# Altium schematic sheet SPK_P.SchDoc
size A; SheetNumber: 4; SheetTotal: 6; SPICEModelCacheEZHXWKXH: <root> / <DocumentId>EZHXWKXH</DocumentId> / <CacheFrame Number="0"> / <Model Name="2n3904" Kind="MDL"> / <Text>*2N3904 / *Si 310mW  40V 200mA 300MHz pkg:TO-92B 1,2,3 / .MODEL 2N3904 NPN(IS=1.4E-14 BF=300 VAF=100 IKF=0.025 ISE=3E-13 / + BR=7.5 RC=2.4 CJE=4.5E-12 TF=4E-10 CJC=3.5E-12 TR=2.1E-8 XTB=1.5 KF=9E-16 )</Text> / </Model> / <Model Name="2n3906" Kind="MDL"> / <Text>*2N3906 / *Si 310mW  40V 200mA 250MHz pkg:TO-92B 1,2,3 / .MODEL 2N3906 PNP(IS=4E-14 BF=400 VAF=50 IKF=0.02 ISE=7E-15 NE=1.16 / + BR=7.5 RC=2.4 CJE=6.3E-12 VJE=0.75 TF=5E-10 CJC=5.8E-12 VJC=0.75 TR=2.3E-8 / + VJS=0.75 XTB=1.5 KF=6E-16 )</Text> / </Model> / </CacheFrame> / </root>
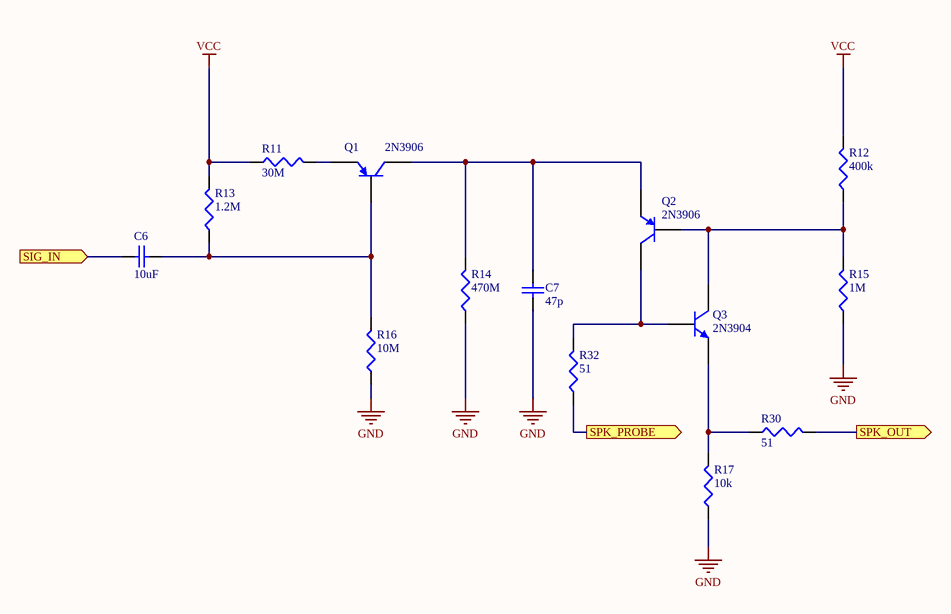
[diagram p0: SPK_P.SchDoc]

## Parts
C6  10uF  [SMD-0603]
C7  47p  [SMD-0603]
Q1  2N3906  [TO-92A]
Q2  2N3906  [TO-92A]
Q3  2N3904  [TO-92A]
R11  30M  [SMD-0603]
R12  400k  [SMD-0603]
R13  1.2M  [SMD-0603]
R14  470M  [SMD-0603]
R15  1M  [SMD-0603]
R16  10M  [SMD-0603]
R17  10k  [SMD-0603]
R30  51  [SMD-0603]
R32  51  [SMD-0603]

## Ports
SIG_IN (in), SPK_OUT (out), SPK_PROBE (out)

## Nets
GND: C7.1 R14.1 R15.1 R16.1 R17.1
VCC: R11.1 R12.2 R13.2
SIG_IN: C6.1 ; port SIG_IN
SPK_OUT: R30.2 ; port SPK_OUT
SPK_PROBE: R32.1 ; port SPK_PROBE
NetC6_2: C6.2 Q1.2(B) R13.1 R16.2
NetC7_2: C7.2 Q1.3(C) Q2.1(E) R14.2
NetQ1_1: Q1.1(E) R11.2
NetQ2_2: Q2.2(B) Q3.3(C) R12.1 R15.2
NetQ2_3: Q2.3(C) Q3.2(B) R32.2
NetQ3_1: Q3.1(E) R17.2 R30.1

## Library data of the parts
C6 C7 = CAP0603: Ceramic Capacitor 0603
Q1 Q2 = 2N3906: PNP General Purpose Amplifier; Published: 8-Jun-2000; LatestRevisionDate: 15-Jan-2003; LatestRevisionNote: PCB Footprint 'BCY-W3/D4.7' replaced; DatasheetVersion: 1997; PackageVersion: Sep-1998; PackageReference: TO-92A; Publisher: Altium Limited; PackageDescription: TO, Flat Index; 3 In-Line, Axial Leads; Body Dia. 4.5mm; Leads 0.51 x 0.48 mm (max); ComponentLink1Description: Manufacturer Link; ComponentLink1URL: http://www.fairchildsemi.com/; ComponentLink2Description: Datasheet; ComponentLink2URL: http://www.fairchildsemi.com/ds/2N%2F2N3906.pdf
Q3 = 2N3904: NPN General Purpose Amplifier; Published: 8-Jun-2000; LatestRevisionDate: 15-Jan-2003; LatestRevisionNote: PCB Footprint 'BCY-W3/D4.7' replaced; DatasheetVersion: 1997; PackageVersion: Sep-1998; PackageReference: TO-92A; Publisher: Altium Limited; PackageDescription: TO, Flat Index; 3 In-Line, Axial Leads; Body Dia. 4.5mm; Leads 0.51 x 0.48 mm (max); ComponentLink1Description: Manufacturer Link; ComponentLink1URL: http://www.fairchildsemi.com/; ComponentLink2Description: Datasheet; ComponentLink2URL: http://www.fairchildsemi.com/ds/2N%2F2N3904.pdf
R11-R17 R30 R32 = RES0603: Resistor-0603